# EAGLE design hub (EAGLE 9.5.1)

## Sheet 1 of 6: Power
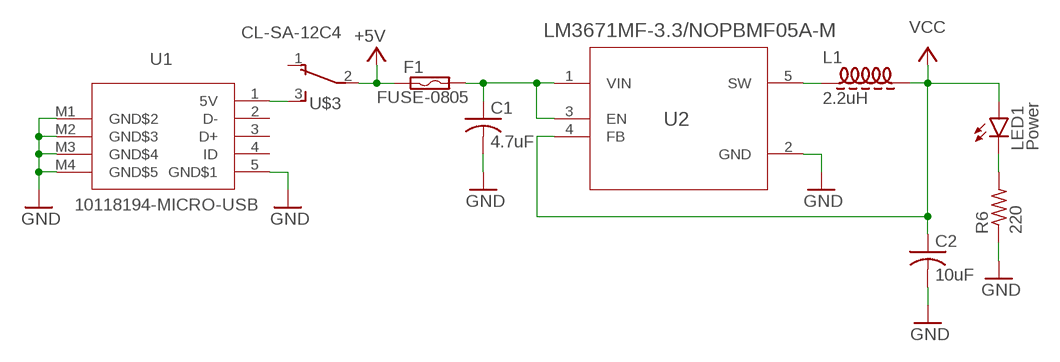
[diagram p0: schematic, sheet 1]

### Parts
C1  4.7uF  C-USC0805  [C0805]
C2  10uF  C-USC0805  [C0805]
F1  FUSE-0805  [R0805]
L1  2.2uH  IND-0805  [R0805]
LED1  Power  LEDCHIPLED_0805  [CHIPLED_0805]
R6  220  R-US_R0805  [R0805]
U1  10118194-MICRO-USB  [10118194-MICRO-USB]
U2  LM3671MF-3.3/NOPBMF05A-M  [MF05A-M]
U$3  CL-SA-12C4  [CL-SA-12C4]

### Nets
+5V: F1.1 U$3.2 ; also sheet 4,6
GND: C1.2 C2.2 R6.1 U1.5(GND$1) U1.M1(GND$2) U1.M2(GND$3) U1.M3(GND$4) U1.M4(GND$5) U2.2(GND) ; also sheet 2,3,4,5,6
N$1: L1.1 U2.5(SW)
N$2: U1.1(5V) U$3.3
N$3: C1.1 F1.2 U2.1(VIN) U2.3(EN)
N$10: LED1.C R6.2
VCC: C2.1 L1.2 LED1.A U2.4(FB) ; also sheet 2,3,4,5,6
Unconnected: U1.2(D-) U1.3(D+) U1.4(ID) U$3.1

## Sheet 2 of 6: ESP
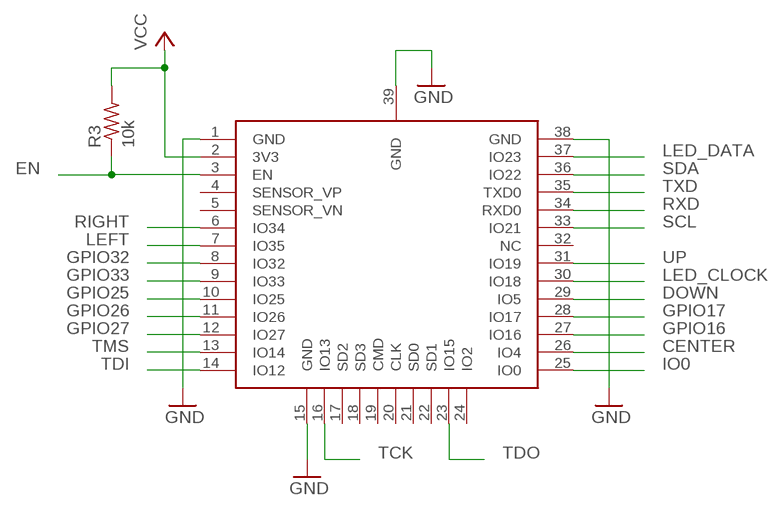
[diagram p1: schematic, sheet 2]

### Parts
R3  10k  R-US_R0805  [R0805]
U$2  ESP32-WROOM-32D  [ESP32-WROOM-32D]

### Nets
CENTER: U$2.26(IO4) ; also sheet 5
DOWN: U$2.29(IO5) ; also sheet 5
EN: R3.1 U$2.3(EN) ; also sheet 3,6
GND: U$2.1(GND) U$2.15(GND) U$2.38(GND) U$2.39(GND) ; also sheet 1,3,4,5,6
GPIO16: U$2.27(IO16) ; also sheet 6
GPIO17: U$2.28(IO17) ; also sheet 6
GPIO25: U$2.10(IO25) ; also sheet 6
GPIO26: U$2.11(IO26) ; also sheet 6
GPIO27: U$2.12(IO27) ; also sheet 6
GPIO32: U$2.8(IO32) ; also sheet 6
GPIO33: U$2.9(IO33) ; also sheet 6
IO0: U$2.25(IO0) ; also sheet 3
LED_CLOCK: U$2.30(IO18) ; also sheet 4
LED_DATA: U$2.37(IO23) ; also sheet 4
LEFT: U$2.7(IO35) ; also sheet 5
RIGHT: U$2.6(IO34) ; also sheet 5
RXD: U$2.34(RXD0) ; also sheet 3
SCL: U$2.33(IO21) ; also sheet 5
SDA: U$2.36(IO22) ; also sheet 5
TCK: U$2.16(IO13) ; also sheet 6
TDI: U$2.14(IO12) ; also sheet 6
TDO: U$2.23(IO15) ; also sheet 6
TMS: U$2.13(IO14) ; also sheet 6
TXD: U$2.35(TXD0) ; also sheet 3
UP: U$2.31(IO19) ; also sheet 5
VCC: R3.2 U$2.2(3V3) ; also sheet 1,3,4,5,6
Unconnected: U$2.4(SENSOR_VP) U$2.5(SENSOR_VN) U$2.17(SD2) U$2.18(SD3) U$2.19(CMD) U$2.20(CLK) U$2.21(SD0) U$2.22(SD1) U$2.24(IO2) U$2.32(NC)

## Sheet 3 of 6: FTDI
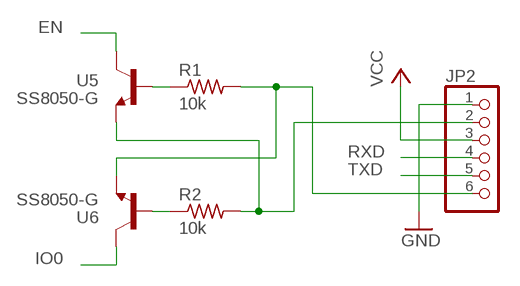
[diagram p2: schematic, sheet 3]

### Parts
JP2  FTDI  PINHD-1X6  [1X06]
R1  10k  R-US_R0805  [R0805]
R2  10k  R-US_R0805  [R0805]
U5  SS8050-G  [SC-59]
U6  SS8050-G  [SC-59]

### Nets
EN: U5.3(C) ; also sheet 2,6
GND: JP2.1 ; also sheet 1,2,4,5,6
IO0: U6.3(C) ; also sheet 2
N$4: R1.1 U5.1(B)
N$5: R2.1 U6.1(B)
N$6: JP2.2 R2.2 U5.2(E)
N$12: JP2.6 R1.2 U6.2(E)
RXD: JP2.4 ; also sheet 2
TXD: JP2.5 ; also sheet 2
VCC: JP2.3 ; also sheet 1,2,4,5,6

## Sheet 4 of 6: LED
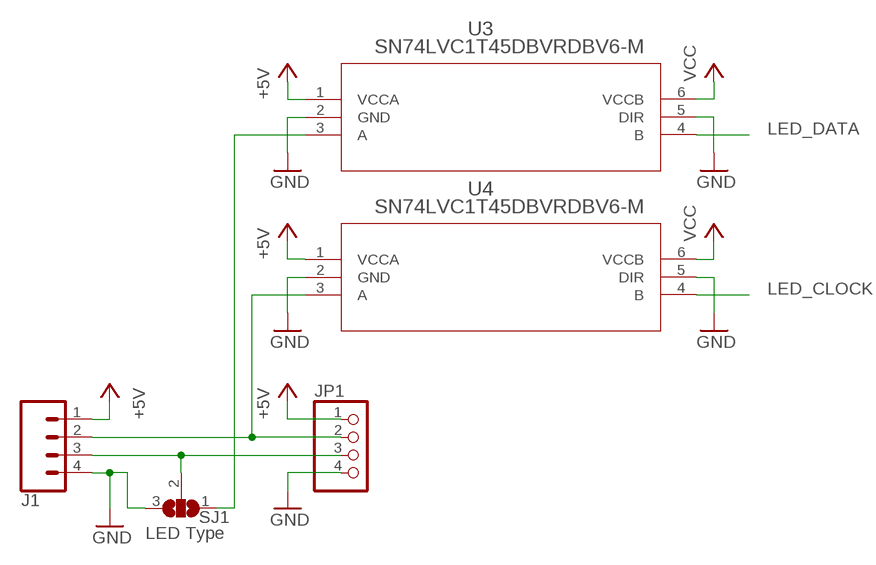
[diagram p3: schematic, sheet 4]

### Parts
J1  CONN_04SCREW  [SCREWTERMINAL-3.5MM-4]
JP1  PINHD-1X4  [1X04]
SJ1  LED Type  SJ2W  [SJ_2]
U3  SN74LVC1T45DBVRDBV6-M  [DBV6-M]
U4  SN74LVC1T45DBVRDBV6-M  [DBV6-M]

### Nets
+5V: J1.1 JP1.1 U3.1(VCCA) U4.1(VCCA) ; also sheet 1,6
GND: J1.4 JP1.4 SJ1.3 U3.2(GND) U3.5(DIR) U4.2(GND) U4.5(DIR) ; also sheet 1,2,3,5,6
LED_CLOCK: U4.4(B) ; also sheet 2
LED_DATA: U3.4(B) ; also sheet 2
N$7: J1.3 JP1.3 SJ1.2
N$8: SJ1.1 U3.3(A)
N$9: J1.2 JP1.2 U4.3(A)
VCC: U3.6(VCCB) U4.6(VCCB) ; also sheet 1,2,3,5,6

## Sheet 5 of 6: UI
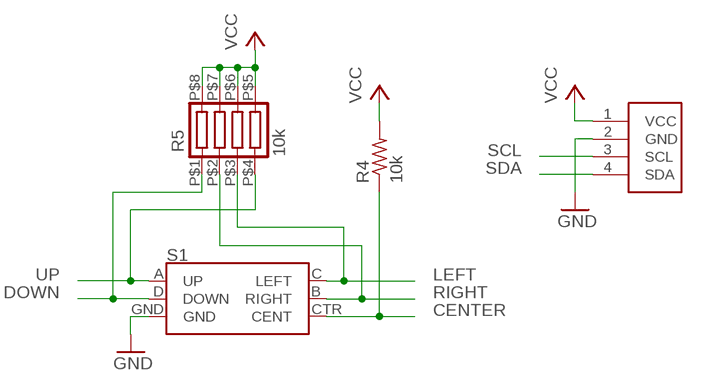
[diagram p4: schematic, sheet 5]

### Parts
R4  10k  R-US_R0805  [R0805]
R5  10k  744C083  [2012-4N-CONCAVE]
S1  JOYSTICK_MINI  [JOYSTICK_MINI]
U$5  SSD1306-OLED  [SSD1306-OLED]

### Nets
CENTER: R4.1 S1.CTR(CENT) ; also sheet 2
DOWN: R5.P$1 S1.D(DOWN) ; also sheet 2
GND: S1.GND U$5.2(GND) ; also sheet 1,2,3,4,6
LEFT: R5.P$3 S1.C(LEFT) ; also sheet 2
RIGHT: R5.P$2 S1.B(RIGHT) ; also sheet 2
SCL: U$5.3(SCL) ; also sheet 2
SDA: U$5.4(SDA) ; also sheet 2
UP: R5.P$4 S1.A(UP) ; also sheet 2
VCC: R4.2 R5.P$5 R5.P$6 R5.P$7 R5.P$8 U$5.1(VCC) ; also sheet 1,2,3,4,6

## Sheet 6 of 6: Extension Headers
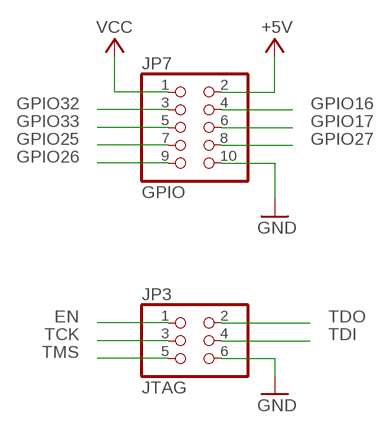
[diagram p5: schematic, sheet 6]

### Parts
JP3  JTAG  PINHD-2X3  [2X03]
JP7  GPIO  PINHD-2X5  [2X05]

### Nets
+5V: JP7.2 ; also sheet 1,4
EN: JP3.1 ; also sheet 2,3
GND: JP3.6 JP7.10 ; also sheet 1,2,3,4,5
GPIO16: JP7.4 ; also sheet 2
GPIO17: JP7.6 ; also sheet 2
GPIO25: JP7.7 ; also sheet 2
GPIO26: JP7.9 ; also sheet 2
GPIO27: JP7.8 ; also sheet 2
GPIO32: JP7.3 ; also sheet 2
GPIO33: JP7.5 ; also sheet 2
TCK: JP3.3 ; also sheet 2
TDI: JP3.4 ; also sheet 2
TDO: JP3.2 ; also sheet 2
TMS: JP3.5 ; also sheet 2
VCC: JP7.1 ; also sheet 1,2,3,4,5

## Library data of the parts
C1 C2 = rcl:C-US: CAPACITOR, American symbol; SPICEPREFIX: C
F1 = nebrius:FUSE-0805
J1 = SparkFun-Connectors:CONN_04: Multi connection point. Often used as Generic Header-pin footprint for 0.1 inch spaced/style header connections On any of the 0.1 inch spaced packages, you can populate with these: Break Away Headers - Straight <https://www.sparkfun.com/products/116> (PRT-00116) Break Away Male Headers - Right Angle <https://www.sparkfun.com/products/553> (PRT-00553) Female Headers <https://www.sparkfun.com/products/115> (PRT-00115) Break Away Headers - Machine Pin <https://www.sparkfun.com/products/117> (PRT-00117) Break Away Female Headers - Swiss Machine Pin <https://www.sparkfun.com/products/743> (PRT-00743) For SCREWTERMINALS and SPRING TERMINALS visit here: Screw Terimnals on SparkFun.com <https://www.sparkfun.com/search/results?term=Screw+Terminals> (5mm/3.5mm/2.54mm spacing) This device is also useful as a general connection point to wire up your design to another part of your project. Our various solder wires solder well into these plated through hole pads. Hook-Up Wire - Assortment (Stranded, 22 AWG) <https://www.sparkfun.com/products/11375> (PRT-11375) Hook-Up Wire - Assortment (Solid Core, 22 AWG) <https://www.sparkfun.com/products/11367> (PRT-11367) View the entire wire category on our website here <https://www.sparkfun.com/categories/141> Special notes: Molex polarized connector foot print use with SKU : PRT-08231 with associated crimp pins and housings. 1MM SMD Version SKU: PRT-10208; PROD_ID: 2xCONN-08399; SF_ID: 2xPRT-08084
JP1 = pinhead:PINHD-1X4: PIN HEADER
JP2 = pinhead:PINHD-1X6: PIN HEADER
JP3 = pinhead:PINHD-2X3: PIN HEADER
JP7 = pinhead:PINHD-2X5: PIN HEADER
L1 = nebrius:IND-0805
LED1 = led:LED: LED OSRAM: - CHIPLED LG R971, LG N971, LY N971, LG Q971, LY Q971, LO R971, LY R971 LH N974, LH R974 LS Q976, LO Q976, LY Q976 LO Q996 - Hyper CHIPLED LW Q18S LB Q993, LB Q99A, LB R99A - SideLED LS A670, LO A670, LY A670, LG A670, LP A670 LB A673, LV A673, LT A673, LW A673 LH A674 LY A675 LS A676, LA A676, LO A676, LY A676, LW A676 LS A679, LY A679, LG A679 - Hyper Micro SIDELED® LS Y876, LA Y876, LO Y876, LY Y876 LT Y87S - SmartLED LW L88C, LW L88S LB L89C, LB L89S, LG L890 LS L89K, LO L89K, LY L89K LS L896, LA L896, LO L896, LY L896 - TOPLED LS T670, LO T670, LY T670, LG T670, LP T670 LSG T670, LSP T670, LSY T670, LOP T670, LYG T670 LG T671, LOG T671, LSG T671 LB T673, LV T673, LT T673, LW T673 LH T674 LS T676, LA T676, LO T676, LY T676, LB T676, LH T676, LSB T676, LW T676 LB T67C, LV T67C, LT T67C, LS T67K, LO T67K, LY T67K, LW E67C LS E67B, LA E67B, LO E67B, LY E67B, LB E67C, LV E67C, LT E67C LW T67C LS T679, LY T679, LG T679 LS T770, LO T770, LY T770, LG T770, LP T770 LB T773, LV T773, LT T773, LW T773 LH T774 LS E675, LA E675, LY E675, LS T675 LS T776, LA T776, LO T776, LY T776, LB T776 LHGB T686 LT T68C, LB T68C - Hyper Mini TOPLED® LB M676 - Mini TOPLED Santana® LG M470 LS M47K, LO M47K, LY M47K Source: http://www.osram.convergy.de LUXEON: - LUMILED® LXK2-PW12-R00, LXK2-PW12-S00, LXK2-PW14-U00, LXK2-PW14-V00 LXK2-PM12-R00, LXK2-PM12-S00, LXK2-PM14-U00 LXK2-PE12-Q00, LXK2-PE12-R00, LXK2-PE12-S00, LXK2-PE14-T00, LXK2-PE14-U00 LXK2-PB12-K00, LXK2-PB12-L00, LXK2-PB12-M00, LXK2-PB14-N00, LXK2-PB14-P00, LXK2-PB14-Q00 LXK2-PR12-L00, LXK2-PR12-M00, LXK2-PR14-Q00, LXK2-PR14-R00 LXK2-PD12-Q00, LXK2-PD12-R00, LXK2-PD12-S00 LXK2-PH12-R00, LXK2-PH12-S00 LXK2-PL12-P00, LXK2-PL12-Q00, LXK2-PL12-R00 Source: www.luxeon.com KINGBRIGHT: KA-3528ASYC Source: www.kingbright.com
R1-R4 R6 = rcl:R-US_: RESISTOR, American symbol; SPICEPREFIX: R
R5 = nebrius:744C083
S1 = SparkFun-Switches:JOYSTICK_MINI: Small Tactile Joystick w/ Select Switch A 5-way tactile switch allows for a joystick-like interface in a very small package. Part #: 4UCON SF303GJ26 SparkFun Products 5-way Tactile Switch <https://www.sparkfun.com/products/10063> (COM-10063) Used on SparkFun Block for Intel® Edison - OLED <https://www.sparkfun.com/products/13035> (DEV-13035) Used on CAN-BUS Shield <https://www.sparkfun.com/products/13262> (DEV-13262); PROD_ID: SWCH-09905; SF_SKU: COM-10063
SJ1 = jumper:SJ2W: SMD solder JUMPER
U1 = nebrius:10118194-MICRO-USB: Surface mount micro USB connector
U2 = nebrius:LM3671MF-3.3/NOPB; MANUFACTURER_PART_NUMBER: LM3671MF3.3NOPB; VENDOR: Texas Instruments
U3 U4 = nebrius:SN74LVC1T45DBVR; MANUFACTURER_PART_NUMBER: SN74LVC1T45DBVR; VENDOR: Texas Instruments
U5 U6 = nebrius:SS8050-G
U$2 = nebrius:ESP32-WROOM-32D
U$3 = nebrius:CL-SA-12C4
U$5 = nebrius:SSD1306-OLED

## Board
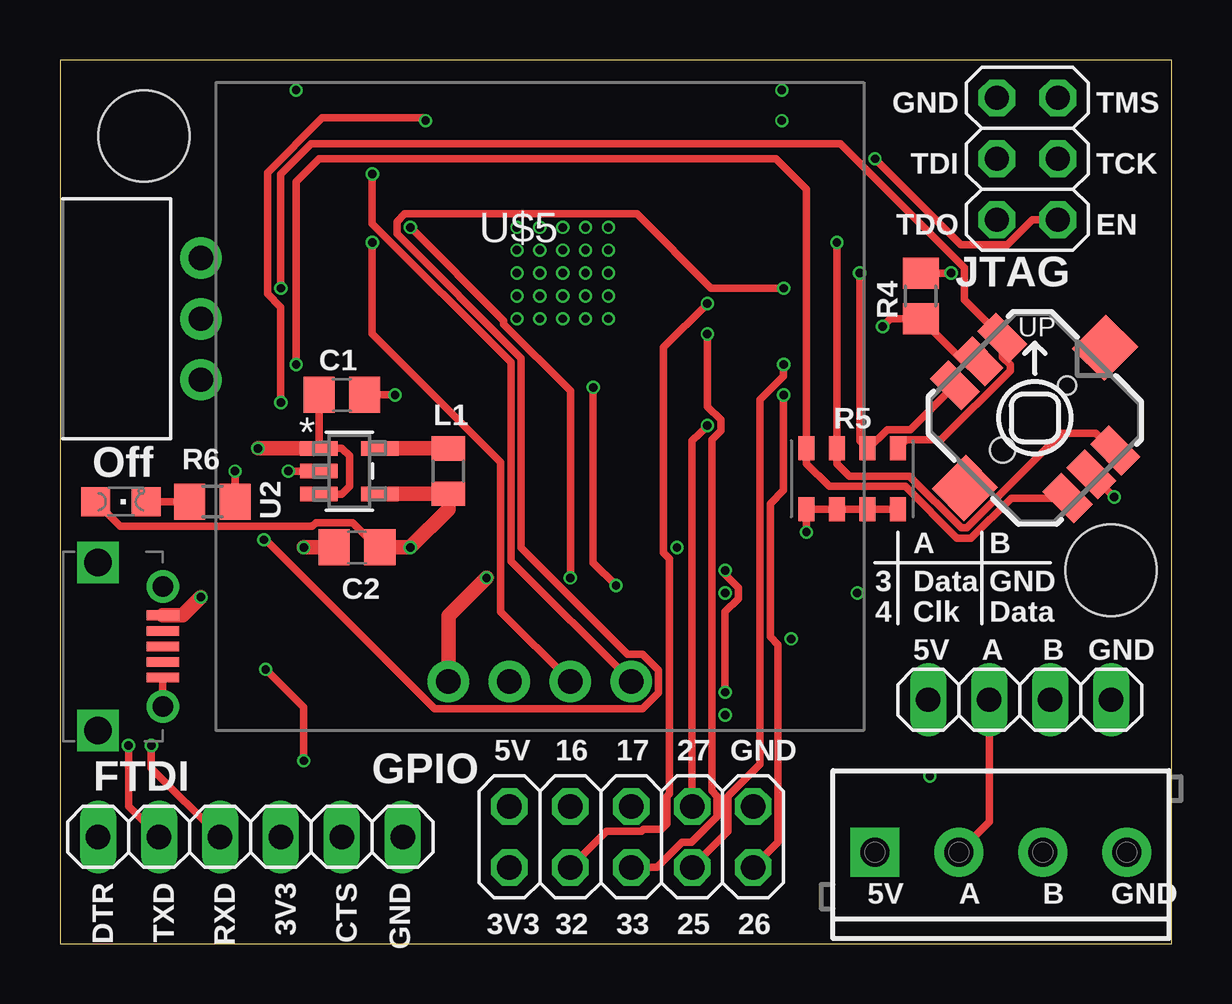
[diagram p6: board, top side]
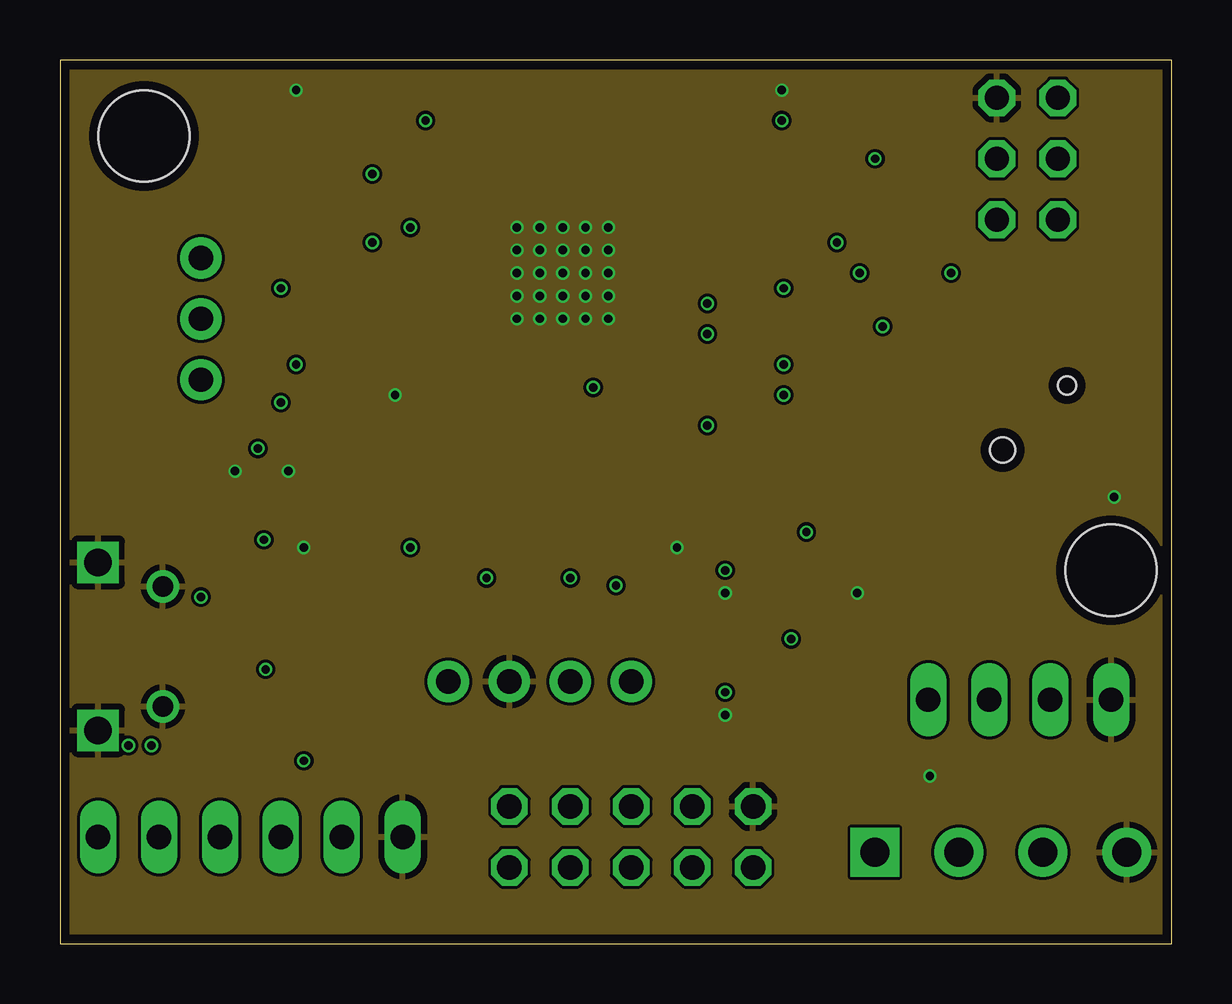
[diagram p7: board, inner layer Route2]
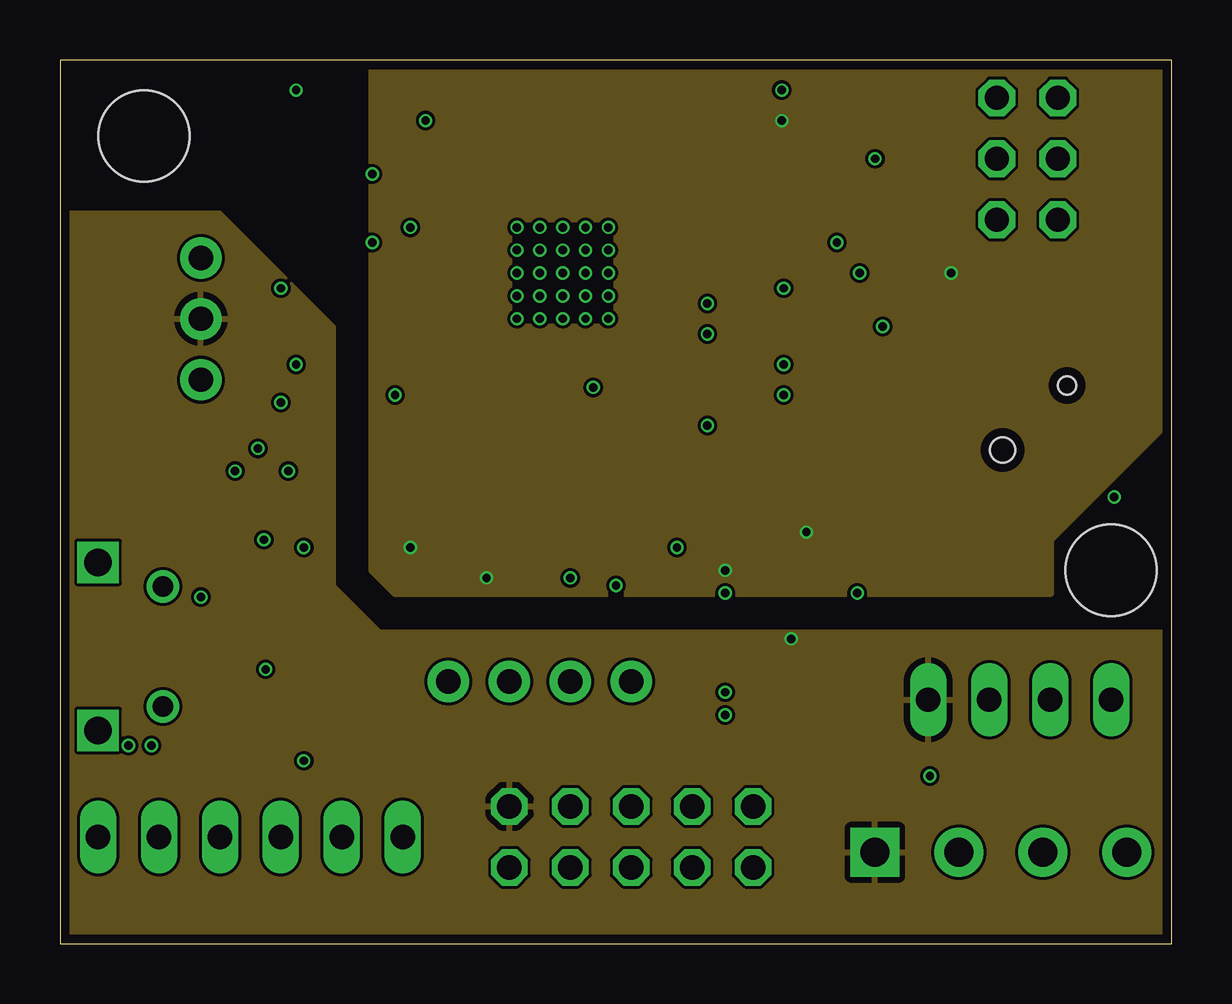
[diagram p8: board, inner layer Route15]
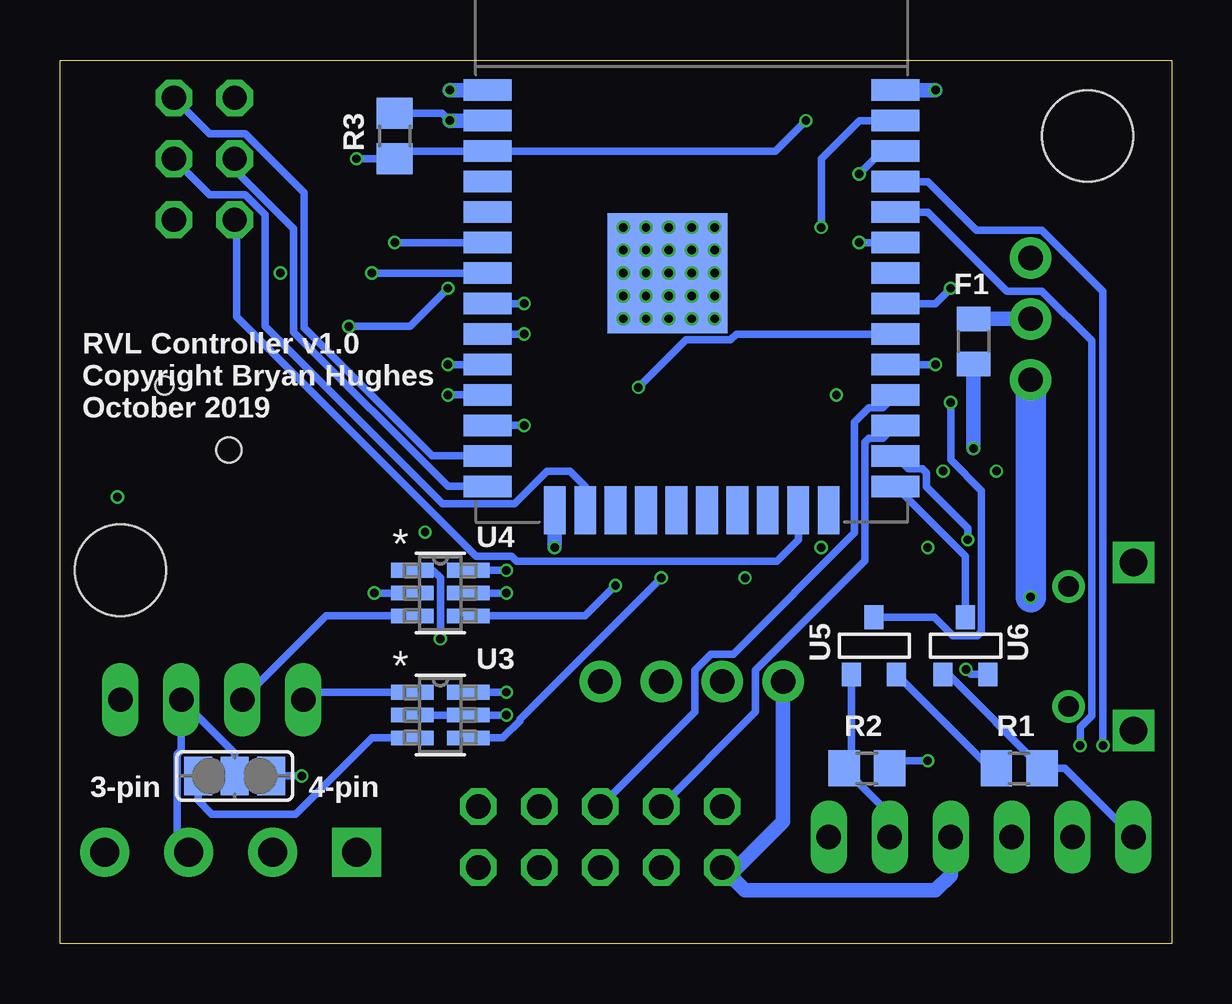
[diagram p9: board, bottom side, seen from below]

Size 46.33 x 36.82 mm. Coordinates in mm from the lower left corner, seen from the top.
Outline: 0,0 46.33,0 46.33,36.82 0,36.82 0,0
Copper layers (1*2*15*16): Top 0.035559375mm / dielectric 0.17018125mm / Route2 0.01778125mm / dielectric 47mil / Route15 0.01778125mm / dielectric 0.17018125mm / Bottom 0.035559375mm
Design rules "oshpark-4layer": minimum track width 5mil, minimum drill 10mil, track to track 5mil, track to pad 5mil, pad to pad 5mil, via to via 5mil, smd to smd 5mil, copper to edge 15mil, drill to drill 6mil, minimum pad ring 4mil, minimum via ring 4mil, stop-mask expansion 2.5mil, vias tented up to drill 0mil, thermal gap 10mil
Holes 3.8 mm at 3.49,33.66 43.81,15.56

### Footprints (pad centres in the part's own frame; a part is rotated, then mirrored left to right if it is on the bottom)
C0805 = smd 1.3 x 1.5: 1 -0.95,0; 2 0.95,0
R0805 = smd 1.02 x 1.4: 1 -0.94,0; 2 0.94,0
SCREWTERMINAL-3.5MM-4 = drill 1.2 pad 2.032 square: 1 0,0 | drill 1.2 pad 2.032: 2 3.5,0; 3 7,0; 4 10.5,0
1X04 = drill 1.016 long: 1 -3.81,0; 2 -1.27,0; 3 1.27,0; 4 3.81,0
1X06 = drill 1.016 long: 1 -6.35,0; 2 -3.81,0; 3 -1.27,0; 4 1.27,0; 5 3.81,0; 6 6.35,0
2X03 = drill 1.016 octagon: 1 -2.54,-1.27; 2 -2.54,1.27; 3 0,-1.27; 4 0,1.27; 5 2.54,-1.27; 6 2.54,1.27
2X05 = drill 1.016 octagon: 1 -5.08,-1.27; 2 -5.08,1.27; 3 -2.54,-1.27; 4 -2.54,1.27; 5 0,-1.27; 6 0,1.27; 7 2.54,-1.27; 8 2.54,1.27; 9 5.08,-1.27; 10 5.08,1.27
CHIPLED_0805 = smd 1.2 x 1.2: A 0,-1.05; C 0,1.05
R0805' = smd 1.3 x 1.5: 1 -0.95,0; 2 0.95,0
2012-4N-CONCAVE = smd 0.65 x 1: P$1 -1.905,1.27; P$2 -0.635,1.27; P$3 0.635,1.27; P$4 1.905,1.27; P$5 1.905,-1.27; P$6 0.635,-1.27; P$7 -0.635,-1.27; P$8 -1.905,-1.27
JOYSTICK_MINI = smd 1.85 x 1.1: A -3.325,1.4; B 3.325,1.4; C -3.325,-1.4; CTR -3.325,0; D 3.325,-1.4; GND 3.325,0 | smd 1.9 x 2: NC 0,4.13; NC@0 0,-4.13 | hole 0.75: 0,1.9 | hole 1.05: 0,-1.9
SJ_2 = smd 1.168 x 1.6: 1 -1.524,0; 2 0,0; 3 1.524,0
10118194-MICRO-USB = smd 0.4 x 1.35: 1 -1.3,2.7; 2 -0.65,2.7; 3 0,2.7; 4 0.65,2.7; 5 1.3,2.7 | drill 0.85 pad 1.35: M1 -2.5,2.7; M2 2.5,2.7 | drill 1.15 pad 1.55 square: M3 -3.5,0; M4 3.5,0
MF05A-M = smd 1.559 x 0.608: 1 -1.269,0.953; 2 -1.269,0; 3 -1.269,-0.953; 4 1.269,-0.953; 5 1.269,0.953
DBV6-M = smd 1.778 x 0.61: 1 -1.168,0.95; 2 -1.168,0; 3 -1.168,-0.95; 4 1.168,-0.95; 5 1.168,0; 6 1.168,0.95
SC-59 = smd 0.787 x 0.991: 1 -0.914,1.168; 2 0.965,1.168; 3 0.025,-1.219
ESP32-WROOM-32D = smd 2 x 0.9: 1 -8.5,0; 2 -8.5,-1.27; 3 -8.5,-2.54; 4 -8.5,-3.81; 5 -8.5,-5.08; 6 -8.5,-6.35; 7 -8.5,-7.62; 8 -8.5,-8.89; 9 -8.5,-10.16; 10 -8.5,-11.43; 11 -8.5,-12.7; 12 -8.5,-13.97; 13 -8.5,-15.24; 14 -8.5,-16.51; 25 8.5,-16.51; 26 8.5,-15.24; 27 8.5,-13.97; 28 8.5,-12.7; 29 8.5,-11.43; 30 8.5,-10.16; 31 8.5,-8.89; 32 8.5,-7.62; 33 8.5,-6.35; 34 8.5,-5.08; 35 8.5,-3.81; 36 8.5,-2.54; 37 8.5,-1.27; 38 8.5,0 | smd 0.9 x 2: 15 -5.715,-17.51; 16 -4.445,-17.51; 17 -3.175,-17.51; 18 -1.905,-17.51; 19 -0.635,-17.51; 20 0.635,-17.51; 21 1.905,-17.51; 22 3.175,-17.51; 23 4.445,-17.51; 24 5.715,-17.51 | smd 5 x 5: 39 -1,-7.62
CL-SA-12C4 = drill 1.016 pad 1.727: 1 -2.54,0; 2 0,0; 3 2.54,0
SSD1306-OLED = drill 1.016 pad 1.727: 1 -3.81,2.032; 2 -1.27,2.032; 3 1.27,2.032; 4 3.81,2.032

### Placement (x,y rotation side)
C1  11.75,22.86 0 top
C2  12.38,16.51 180 top
F1  8.25,25.08 270 bottom
J1  33.97,3.81 0 top
JP1  40,10.16 0 top
JP2  7.94,4.45 180 top
JP3  40.32,32.7 90 top
JP7  23.81,4.45 0 top
L1  16.19,19.69 270 top
LED1  2.54,18.42 270 top
R1  10k  [R0805']  6.35,7.3 0 bottom
R2  10k  [R0805']  12.7,7.3 180 bottom
R3  10k  [R0805']  32.38,33.66 90 bottom
R4  10k  [R0805']  35.88,26.99 90 top
R5  33.02,19.37 0 top
R6  220  [R0805']  6.35,18.42 180 top
S1  40.64,21.91 315 top
SJ1  39.05,6.98 0 bottom
U1  1.59,12.38 270 top
U2  12.06,19.69 0 top
U3  30.48,9.52 0 bottom
U4  30.48,14.61 0 bottom
U5  12.38,12.38 180 bottom
U6  8.57,12.38 180 bottom
U$2  20,35.56 0 bottom
U$3  5.87,26.03 270 top
U$5  20,8.89 0 top

### Tracks (layer width: path | path; a pad name or v marks a point on that pad's centre or on a via)
+5V  (via drill 0.35)
  Bottom 0.305: U3.1 35.88,10.48 JP1.1 | U4.1 30.8,15.55 30.48,15.24 v30.48,12.7
  Bottom 0.61: U$3.2 8.24,26.03 F1.1
  pour Route15: 46.35,0 46.35,13.02 13.33,13.02 11.43,14.92 11.43,25.72 6.67,30.48 0,30.48 0,0
CENTER  (via drill 0.35)
  Top 0.305: S1.CTR 37.66,24.26 R4.1 34.61,26.04 v34.29,25.72 | v30.16,27.31 27.14,27.31 24.04,30.4 16.19,30.4 14.37,30.4 14.05,30.08 14.05,29.58 19.23,24.4 19.23,16.5 23.66,12.06 24.29,12.06 24.96,11.4 24.96,10.45 24.29,9.78 15.62,9.78 8.57,16.83 v8.5,16.83
  Bottom 0.305: v34.29,25.72 31.75,25.72 v30.16,27.31 | v8.5,16.83 8.5,17.31 10.22,19.04 10.22,19.62 10.39,19.78 10.96,19.78 U$2.26
DOWN  (via drill 0.35)
  Top 0.305: S1.D 39.65,18.57 37.98,16.9 37.39,16.9 35.24,19.05 32.07,19.05 31.11,20 R5.P$1 31.11,31.43 29.85,32.7 10.8,32.7 9.84,31.75 v9.84,24.13
  Bottom 0.305: v9.84,24.13 U$2.29
EN  (via drill 0.35)
  Top 0.305: JP3.1 40.53,30.16 39.48,29.12 37.55,29.12 v33.97,32.7 | v15.24,34.29 15.13,34.4 10.93,34.4 8.65,32.12 8.65,27.08 9.21,26.52 v9.21,22.54
  Bottom 0.305: v33.97,32.7 R3.1 32.07,33.02 U$2.3 16.51,33.02 v15.24,34.29 | v9.21,22.54 9.21,20.15 7.92,18.87 7.92,12.99 8.09,12.83 9.11,12.83 9.88,13.6 U5.3
GND  (via drill 0.35)
  Top 0.305: U1.5 U1.M2 | U2.2 v9.52,19.69 | C1.2 v13.97,22.86 | S1.GND v43.94,18.6 | R6.1 v7.3,19.69
  Top 0.61: C2.2 v10.16,16.51
  Bottom 0.305: v36.26,6.98 SJ1.3 | v27.72,14.61 U4.5 | U4.2 v33.24,14.61 | v27.72,9.52 U3.5 U3.2
  Bottom 0.61: U$2.1 v30.09,35.56 | U$2.15 v25.72,16.51 | U$2.38 v9.84,35.56 | U$2.39 20.96,27.89 v20.96,26.99
  other vias: 19.05,29.84 19.05,28.89 20,26.99 19.05,27.94 19.05,26.99 19.05,26.03 20,26.03 20.95,26.03 21.91,26.03 22.86,26.03 20,27.94 20,28.89 20,29.84 20.95,29.84 20.95,28.89 20.95,27.94 21.91,26.99 21.91,27.94 21.91,28.89 21.91,29.84 22.86,29.84 22.86,28.89 22.86,27.94 22.86,26.99
  pour Route2: 0,36.83 46.35,36.83 46.35,0 0,0
GPIO16
  Bottom 0.305: JP7.4 17.34,9.65 17.34,11.4 12.78,15.95 12.78,20.89 12.62,21.05 12.04,21.05 U$2.27
GPIO17
  Bottom 0.305: JP7.6 19.88,9.65 19.88,11.4 19.21,12.06 18.26,12.06 13.21,17.11 13.21,21.72 12.62,22.32 12.04,22.32 U$2.28
GPIO25  (via drill 0.35)
  Top 0.305: JP7.7 27.85,4.67 27.85,6.15 29.17,7.47 29.17,22.66 30.16,23.65 v30.16,24.13
  Bottom 0.305: v30.16,24.13 U$2.10
GPIO26  (via drill 0.35)
  Top 0.305: v30.16,22.86 30.16,18.88 29.61,18.33 29.61,12.79 29.93,12.46 29.93,4.22 JP7.9
  Bottom 0.305: v30.16,22.86 U$2.11
GPIO27  (via drill 0.35)
  Top 0.305: JP7.8 26.35,20.95 26.67,21.27 v26.99,21.59
  Bottom 0.305: v26.99,21.59 U$2.12
GPIO32  (via drill 0.35)
  Top 0.305: JP7.3 22.77,4.67 24.24,4.67 24.33,4.76 25.08,4.76 25.31,4.99 25.31,6.15 25.4,6.23 25.4,16.04 25.16,16.28 25.16,24.84 v26.99,26.67
  Bottom 0.305: v26.99,26.67 U$2.8
GPIO33  (via drill 0.35)
  Top 0.305: v26.99,25.4 26.99,22.38 27.54,21.82 27.54,21.36 27.17,20.98 27.17,6.37 27.39,6.15 27.39,5.28 26.33,4.22 25.92,4.22 24.88,3.18 JP7.5
  Bottom 0.305: v26.99,25.4 U$2.9
IO0
  Bottom 0.305: U6.3 8.6,16.15 U$2.25
LED_CLOCK  (via drill 0.35)
  Top 0.305: v23.18,14.92 22.22,15.88 v22.22,23.18
  Bottom 0.305: U4.4 24.44,13.66 v23.18,14.92 | v22.22,23.18 20.24,25.16 18.39,25.16 18.15,25.4 U$2.30
LED_DATA  (via drill 0.35)
  Top 0.305: v14.6,29.84 18.49,25.96 18.49,25.81 21.27,23.03 v21.27,15.24
  Bottom 0.305: v21.27,15.24 27.17,9.34 27.17,9.3 27.89,8.58 U3.4 | v14.6,29.84 14.6,32.7 13.02,34.29 U$2.37
LEFT  (via drill 0.35)
  Top 0.305: S1.C 35.45,21.42 34.48,21.42 33.7,20.64 R5.P$3 33.34,20.95 v33.34,27.94
  Bottom 0.305: v33.34,27.94 U$2.7
N$1
  Top 0.61: U2.5 16.18,20.64 L1.1
N$2  (via drill 0.35)
  Top 0.61: U1.1 5.11,13.68 v5.86,14.44 v5.87,14.44
  Bottom 1.27: U$3.3 v5.87,14.44
N$3  (via drill 0.35)
  Top 0.305: U2.3 11.75,18.73 12.07,19.05 12.07,20.32 11.75,20.64 U2.1 C1.1
  Top 0.61: v8.25,20.64 U2.1
  Bottom 0.61: F1.2 v8.25,20.64
N$4
  Bottom 0.305: U5.1 7.56,7.3 R1.1
N$5  (via drill 0.35)
  Top 0.305: v10.16,7.62 10.16,9.84 v8.57,11.43
  Bottom 0.305: v8.57,11.43 8.36,11.21 U6.1 | v10.16,7.62 11.43,7.62 R2.1
N$6
  Bottom 0.305: JP2.2 11.75,5.4 R2.2 13.35,7.61 U5.2
N$7
  Bottom 0.305: SJ1.2 39.05,7.94 JP1.3 41.27,8.07 41.44,7.9 41.44,4.28 J1.3
N$8
  Bottom 0.305: U3.3 33.33,8.58 36.51,5.4 40,5.4 40.58,5.97 SJ1.1
N$9
  Top 0.305: JP1.2 38.74,5.07 J1.2
  Bottom 0.305: U4.3 35.24,13.66 JP1.2
N$10
  Top 0.305: LED1.C R6.2
N$12
  Bottom 0.305: JP2.6 4.44,7.3 R1.2 9.31,11.21 U6.2
RIGHT  (via drill 0.35)
  Top 0.305: S1.B 43.91,20.55 43.18,21.27 41.74,21.27 37.8,17.33 37.57,17.33 35.42,19.48 32.91,19.48 32.38,20 R5.P$2 v32.38,29.21
  Bottom 0.305: v32.38,29.21 U$2.6
RXD  (via drill 0.35)
  Top 0.305: JP2.4 3.81,7.3 v3.81,8.26
  Bottom 0.305: v3.81,8.26 3.81,9.01 3.33,9.49 3.33,25.11 5.4,27.18 6.86,27.18 10.16,30.48 U$2.34
SCL  (via drill 0.35)
  Top 0.305: U$5.3 18.36,13.83 18.36,20.06 13.02,25.41 v13.02,29.21
  Bottom 0.305: v13.02,29.21 U$2.33
SDA  (via drill 0.35)
  Top 0.305: U$5.4 18.8,15.94 18.8,24.22 13.02,30 v13.02,32.07
  Bottom 0.305: v13.02,32.07 12.78,32.3 12.78,32.32 12.08,33.02 U$2.36
TCK
  Bottom 0.305: JP3.3 40.09,31.2 38.62,31.2 37.78,30.36 37.78,25.72 30.39,18.32 27.39,18.32 27.22,18.48 27.22,18.5 26.04,19.69 25.08,19.69 24.45,19.05 U$2.16
TDI
  Bottom 0.305: JP3.4 39.05,32.25 36.59,29.78 36.59,25.48 30.16,19.05 U$2.14
TDO
  Bottom 0.305: JP3.2 38.97,30.08 38.97,26.12 28.99,16.14 27.52,16.14 27.31,15.93 16.46,15.93 15.56,16.83 U$2.23
TMS
  Bottom 0.305: JP3.5 40.09,33.74 38.62,33.74 36.16,31.28 36.16,25.66 30.82,20.32 U$2.13
TXD  (via drill 0.35)
  Top 0.305: JP2.5 2.86,5.72 v2.86,8.26
  Bottom 0.305: v2.86,8.26 2.86,27.17 5.4,29.72 8.13,29.72 10.16,31.75 U$2.35
UP  (via drill 0.35)
  Top 0.305: R5.P$4 35.27,20.98 36.72,20.98 39.61,23.88 39.61,24.11 39.28,24.44 S1.A 37.7,26.82 37.7,28.17 32.54,33.34 10.48,33.34 9.21,32.07 v9.21,27.31
  Bottom 0.305: v9.21,27.31 9.84,26.67 U$2.31
VCC  (via drill 0.35)
  Top 0.305: 12.96,16.77 12.2,17.54 10.67,17.54 10.51,17.39 2.52,17.39 LED1.A | v31.11,17.15 R5.P$8 R5.P$7 R5.P$6 R5.P$5 | R4.2 v37.15,27.94 | v27.72,10.48 27.72,13.82 28.28,14.38 28.28,14.84 27.72,15.39 v27.72,15.55
  Top 0.61: U$5.1 16.19,13.65 v17.78,15.24 | U2.4 13.35,18.75 L1.2 16.19,18.1 v14.6,16.51 C2.1 13.23,16.51 12.96,16.77
  Bottom 0.305: v27.72,10.48 U3.6 | v27.72,15.55 U4.6 | v30.09,34.29 30.41,34.61 R3.2
  Bottom 0.61: U$5.1 16.19,5.08 18.1,3.18 JP7.1 17.78,2.22 9.84,2.22 9.21,2.86 JP2.3 | U$2.2 v30.09,34.29
  pour Route15: 41.27,14.61 13.97,14.61 13.02,15.56 13.02,17.15 13.02,36.83 46.35,36.83 46.35,21.91 41.27,16.83

### Text on the board
tPlace: GND | TMS | TDI | TCK | TDO | EN | Off | A | B | 3 | Data | GND | 4 | Clk | Data | 5V | A | B | GND | 5V | 16 | 17 | 27 | GND | DTR | TXD | RXD | 3V3 | CTS | GND | 5V | A | B | GND | 3V3 | 32 | 33 | 25 | 26
bPlace: RVL Controller v1.0 / Copyright Bryan Hughes / October 2019 | 4-pin | 3-pin